# EAGLE schematic Gadget-Box-328pb (EAGLE 6.6.0)

## Sheet 1 of 3
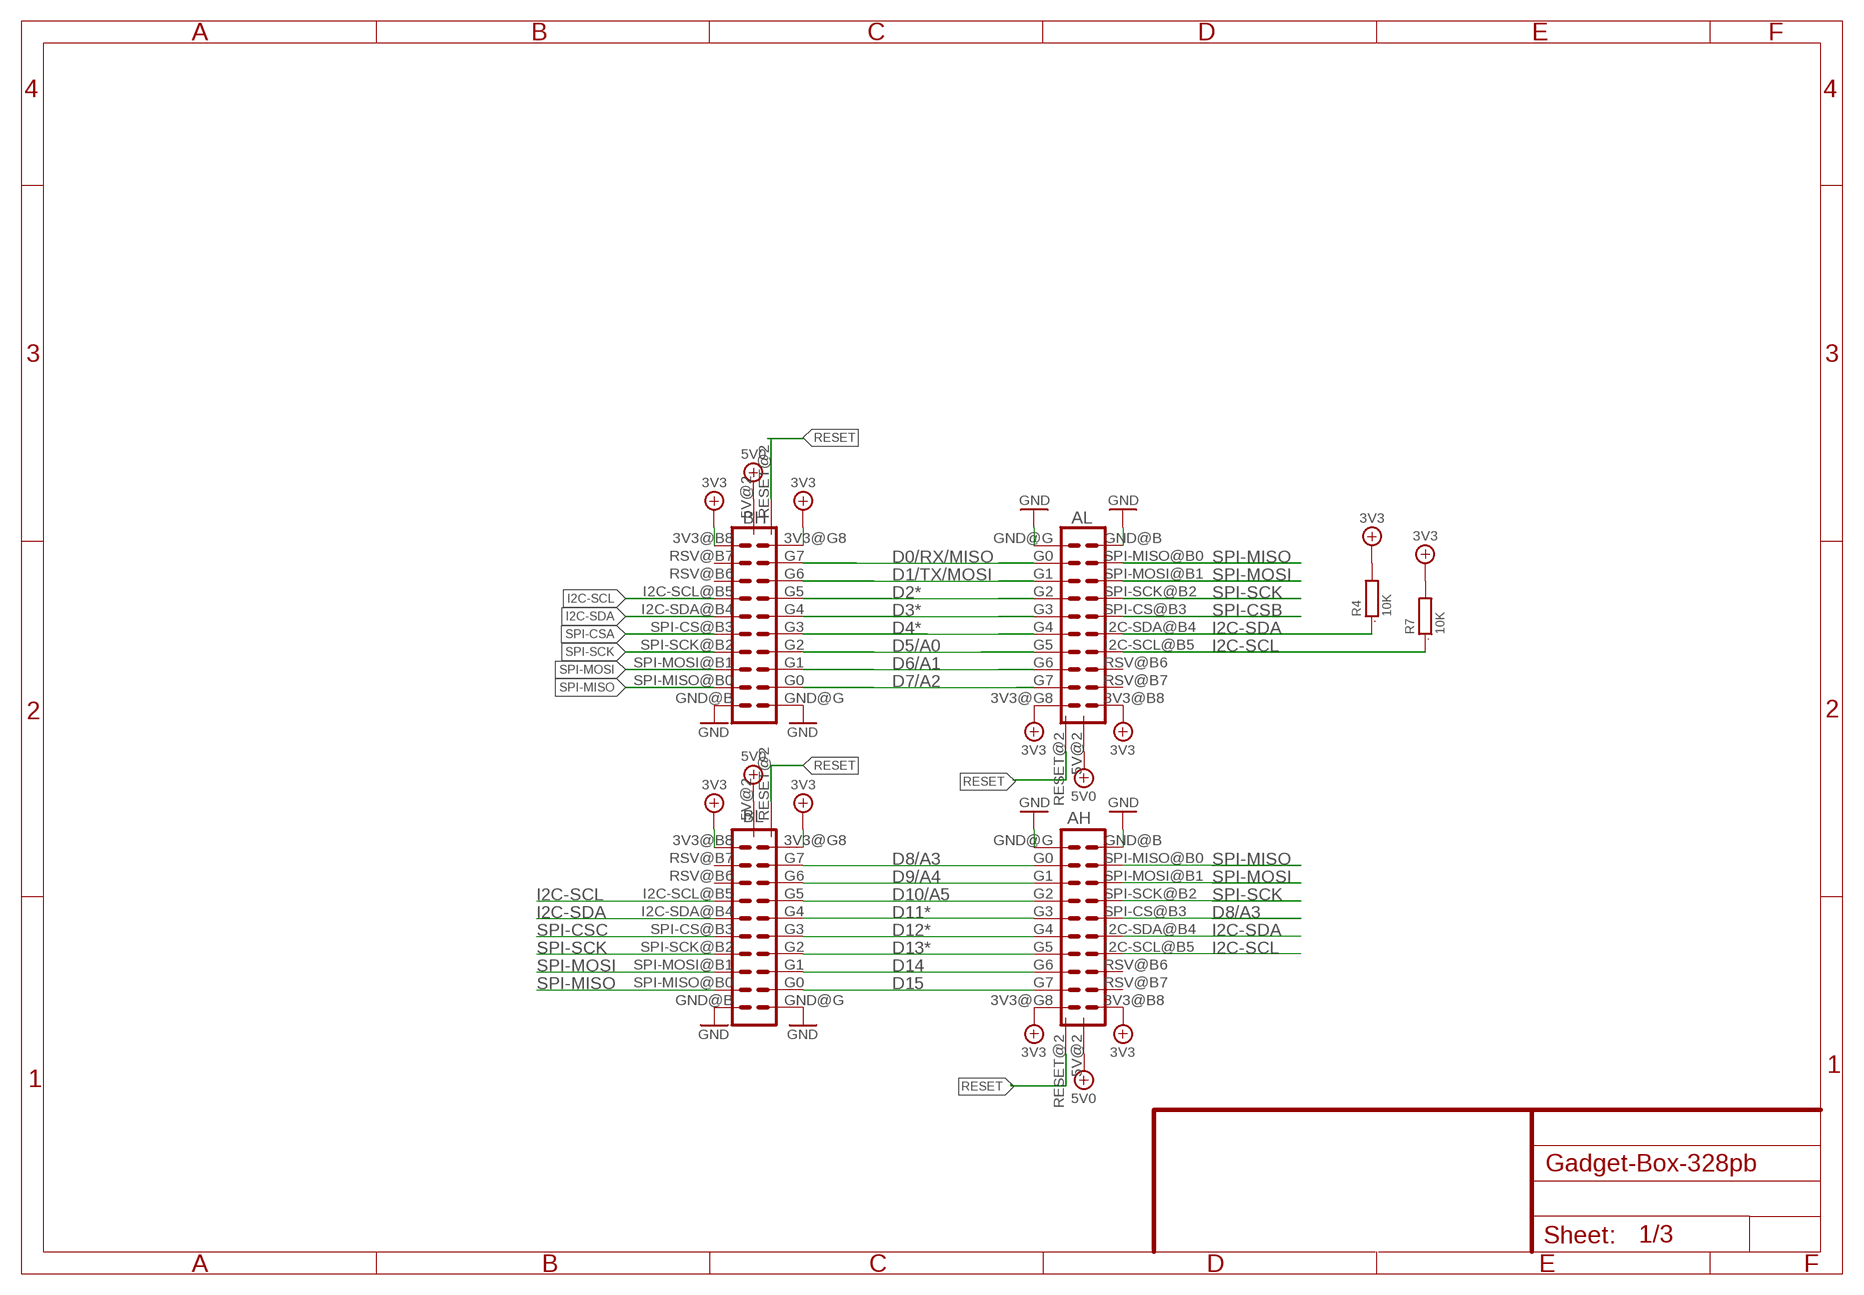
[diagram p0: schematic, sheet 1]

### Parts
AH  ECOGECOG_SLOT_ALT1  [ECOG_ALT1]
AL  ECOGECOG_SLOT_ALT1  [ECOG_ALT1]
BH  ECOGECOG_SLOT_ALT1  [ECOG_ALT1]
BL  ECOGECOG_SLOT_ALT1  [ECOG_ALT1]
R4  10K  R0603  [0603]
R7  10K  R0603  [0603]

### Nets
3V3: AH.3V3@B8(3V3) AH.3V3@G8(3V3) AL.3V3@B8(3V3) AL.3V3@G8(3V3) BH.3V3@B8(3V3) BH.3V3@G8(3V3) BL.3V3@B8(3V3) BL.3V3@G8(3V3) R4.2 R7.2 ; also sheet 2,3
5V0: AH.5V@2(5V) AL.5V@2(5V) BH.5V@2(5V) BL.5V@2(5V) ; also sheet 2
D0/RX/MISO: AL.G0 BH.G7 ; also sheet 3
D1/TX/MOSI: AL.G1 BH.G6 ; also sheet 3
D2*: AL.G2 BH.G5 ; also sheet 3
D3*: AL.G3 BH.G4 ; also sheet 3
D4*: AL.G4 BH.G3 ; also sheet 3
D5/A0: AL.G5 BH.G2 ; also sheet 2,3
D6/A1: AL.G6 BH.G1 ; also sheet 3
D7/A2: AL.G7 BH.G0 ; also sheet 3
D8/A3: AH.G0 AH.SPI-CS@B3(SPI-CS) BL.G7 ; also sheet 3
D9/A4: AH.G1 BL.G6 ; also sheet 3
D10/A5: AH.G2 BL.G5 ; also sheet 3
D11*: AH.G3 BL.G4 ; also sheet 3
D12*: AH.G4 BL.G3 ; also sheet 3
D13*: AH.G5 BL.G2 ; also sheet 3
D14: AH.G6 BL.G1 ; also sheet 3
D15: AH.G7 BL.G0 ; also sheet 3
GND [gnd]: AH.GND@B(GND) AH.GND@G(GND) AL.GND@B(GND) AL.GND@G(GND) BH.GND@B(GND) BH.GND@G(GND) BL.GND@B(GND) BL.GND@G(GND) ; also sheet 2,3
I2C-SCL: AH.I2C-SCL@B5(I2C-SCL) AL.I2C-SCL@B5(I2C-SCL) BH.I2C-SCL@B5(I2C-SCL) BL.I2C-SCL@B5(I2C-SCL) R7.1 ; also sheet 3
I2C-SDA: AH.I2C-SDA@B4(I2C-SDA) AL.I2C-SDA@B4(I2C-SDA) BH.I2C-SDA@B4(I2C-SDA) BL.I2C-SDA@B4(I2C-SDA) R4.1 ; also sheet 3
RESET: AH.RESET@2(RESET) AL.RESET@2(RESET) BH.RESET@2(RESET) BL.RESET@2(RESET) ; also sheet 3
SPI-CSA: BH.SPI-CS@B3(SPI-CS) ; also sheet 3
SPI-CSB: AL.SPI-CS@B3(SPI-CS) ; also sheet 3
SPI-CSC: BL.SPI-CS@B3(SPI-CS) ; also sheet 3
SPI-MISO: AH.SPI-MISO@B0(SPI-MISO) AL.SPI-MISO@B0(SPI-MISO) BH.SPI-MISO@B0(SPI-MISO) BL.SPI-MISO@B0(SPI-MISO) ; also sheet 3
SPI-MOSI: AH.SPI-MOSI@B1(SPI-MOSI) AL.SPI-MOSI@B1(SPI-MOSI) BH.SPI-MOSI@B1(SPI-MOSI) BL.SPI-MOSI@B1(SPI-MOSI) ; also sheet 3
SPI-SCK: AH.SPI-SCK@B2(SPI-SCK) AL.SPI-SCK@B2(SPI-SCK) BH.SPI-SCK@B2(SPI-SCK) BL.SPI-SCK@B2(SPI-SCK) ; also sheet 3
Unconnected: AH.RSV@B6(RSV) AH.RSV@B7(RSV) AL.RSV@B6(RSV) AL.RSV@B7(RSV) BH.RSV@B6(RSV) BH.RSV@B7(RSV) BL.RSV@B6(RSV) BL.RSV@B7(RSV)

## Sheet 2 of 3
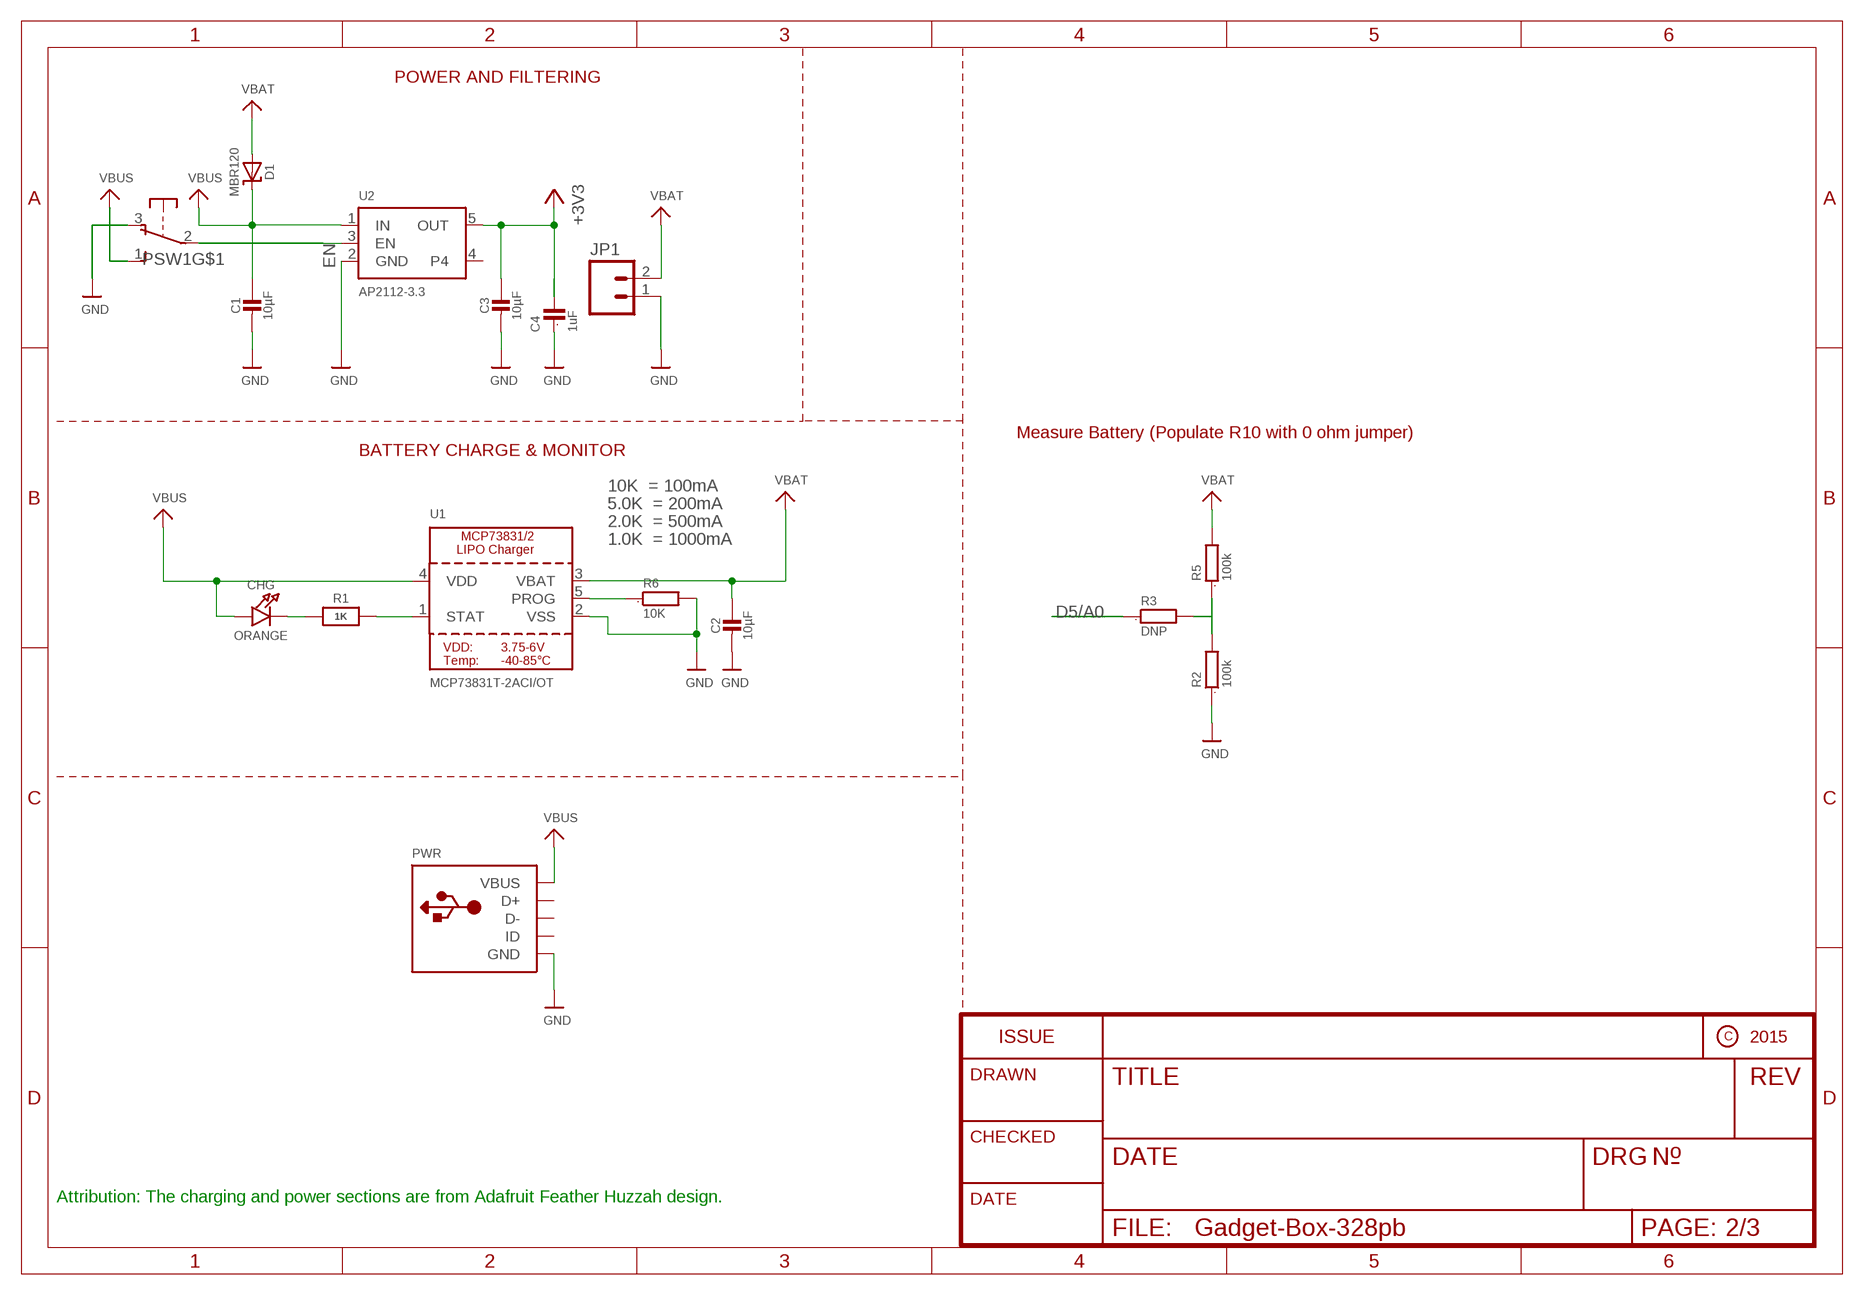
[diagram p1: schematic, sheet 2]

### Parts
C1  10µF  CAP_CERAMIC0805-NOOUTLINE  [0805-NO]
C2  10µF  CAP_CERAMIC0805-NOOUTLINE  [0805-NO]
C3  10µF  CAP_CERAMIC0805-NOOUTLINE  [0805-NO]
C4  1uF  C0603  [0603]
CHG  ORANGE  LED0805_NOOUTLINE  [CHIPLED_0805_NOOUTLINE]
D1  MBR120  DIODE-SCHOTTKYSOD-123  [SOD-123]
JP1  M02-JST-2-PTH-NO_SILK  [JST-2-PTH-NS]
PSW1  OS102011MA1Q  [OS102011MA1Q]
PWR  USBMINIB  [USB-MINIB]
R1  1K  RESISTOR_0603_NOOUT  [0603-NO]
R2  100k  R0603  [0603]
R3  DNP  R0603  [0603]
R5  100k  R0603  [0603]
R6  10K  R0603  [0603]
U1  MCP73831T-2ACI/OT  MCP73831/2  [SOT23-5]
U2  AP2112-3.3  VREG_SOT23-5  [SOT23-5]

### Nets
3V3: C3.1 C4.2 U2.5(OUT) ; supply symbol labelled +3V3 ; also sheet 1,3
5V0: C1.1 CHG.A D1.C PSW1.1(S) PWR.VBUS U1.4(VDD) U2.1(IN) ; supply symbol labelled VBUS ; also sheet 1
D5/A0: R3.1 ; also sheet 1,3
EN: PSW1.2(P) U2.3(EN)
GND [gnd]: C1.2 C2.2 C3.2 C4.1 JP1.1 PSW1.3(O) PWR.GND R2.1 R6.2 U1.2(VSS) U2.2(GND) ; also sheet 1,3
N$1: CHG.C R1.1
N$2: R2.2 R3.2 R5.1
N$3: R1.2 U1.1(STAT)
N$4: R6.1 U1.5(PROG)
VBAT: C2.1 D1.A JP1.2 R5.2 U1.3(VBAT)
Unconnected: PSW1.MT1(MT) PSW1.MT2(MT) PWR.D+ PWR.D- PWR.ID U2.4

### Notes on the sheet
- POWER AND FILTERING
- Measure Battery (Populate R10 with 0 ohm jumper)
- BATTERY CHARGE & MONITOR
- 10K  = 100mA
- 5.0K  = 200mA
- 2.0K  = 500mA
- 1.0K  = 1000mA
- Attribution: The charging and power sections are from Adafruit Feather Huzzah design.

## Sheet 3 of 3
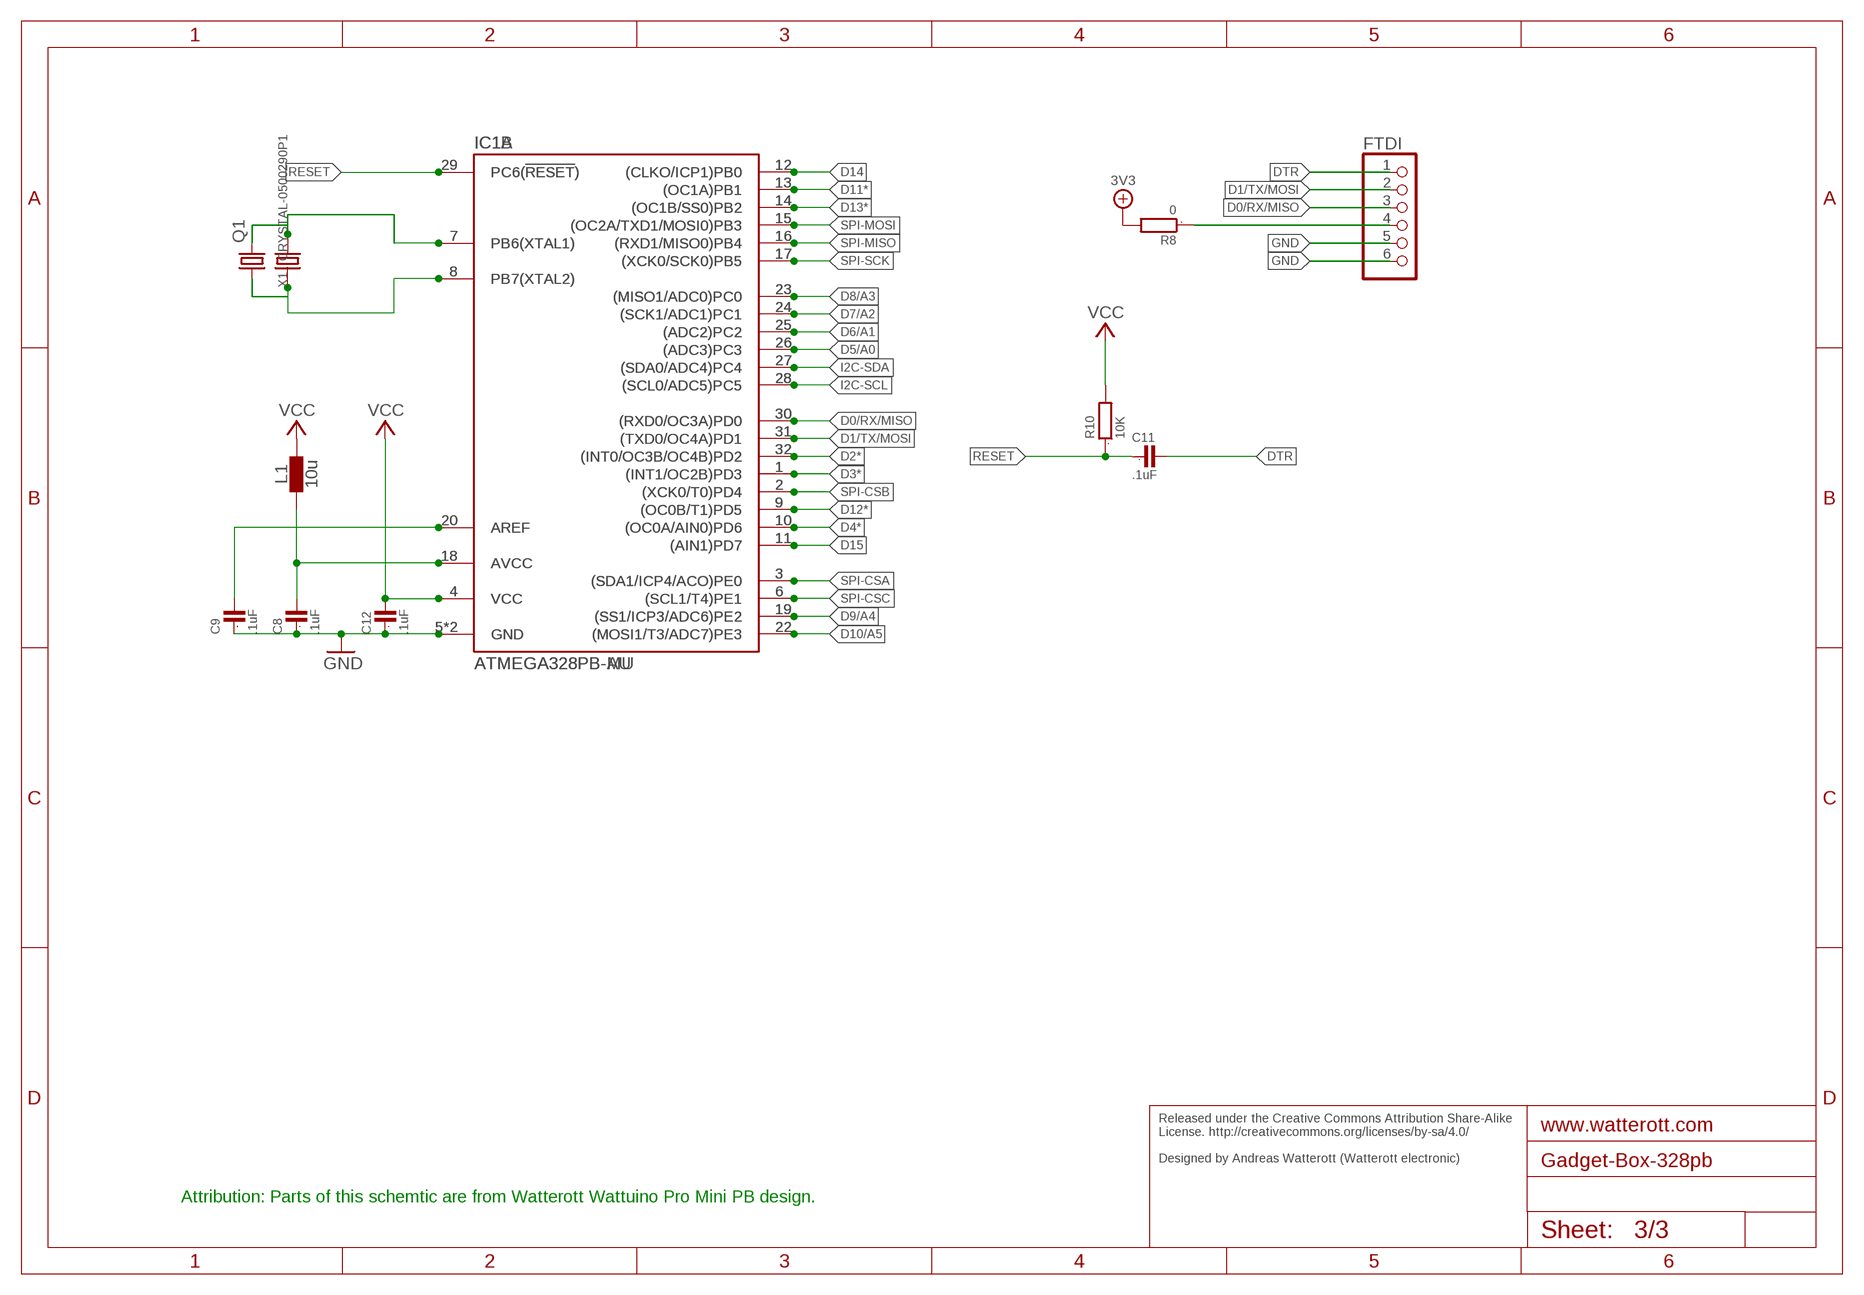
[diagram p2: schematic, sheet 3]

### Parts
C8  .1uF  C0805  [0805]
C9  .1uF  C0805  [0805]
C11  .1uF  C0805  [0805]
C12  .1uF  C0805  [0805]
FTDI  PINHD-1X6  [1X06]
IC1A  ATMEGA328PB-AU  [TQFP32]
IC1B  ATMEGA328PB-MU  [QFN32-PAD]
L1  10u  INDUCTOR-0603  [C0603]
Q1  CRYSTALSM49  [SM49]
R8  0  R0603  [0603]
R10  10K  R0603  [0603]
X1  CRYSTAL-0500290P1  [2P-SMD-5.0X3.2]

### Nets
3V3: C12.2 IC1A.4(VCC) IC1B.4(VCC) L1.2 R8.2 R10.2 ; supply symbol labelled VCC ; also sheet 1,2
AREF: C9.2 IC1A.20(AREF) IC1B.20(AREF)
AVCC: C8.2 IC1A.18(AVCC) IC1B.18(AVCC) L1.1
D0/RX/MISO: FTDI.3 IC1A.30((RXD0/OC3A)PD0) IC1B.30((RXD0/OC3A)PD0) ; also sheet 1
D1/TX/MOSI: FTDI.2 IC1A.31((TXD0/OC4A)PD1) IC1B.31((TXD0/OC4A)PD1) ; also sheet 1
D2*: IC1A.32((INT0/OC3B/OC4B)PD2) IC1B.32((INT0/OC3B/OC4B)PD2) ; also sheet 1
D3*: IC1A.1((INT1/OC2B)PD3) IC1B.1((INT1/OC2B)PD3) ; also sheet 1
D4*: IC1A.10((OC0A/AIN0)PD6) IC1B.10((OC0A/AIN0)PD6) ; also sheet 1
D5/A0: IC1A.26((ADC3)PC3) IC1B.26((ADC3)PC3) ; also sheet 1,2
D6/A1: IC1A.25((ADC2)PC2) IC1B.25((ADC2)PC2) ; also sheet 1
D7/A2: IC1A.24((SCK1/ADC1)PC1) IC1B.24((SCK1/ADC1)PC1) ; also sheet 1
D8/A3: IC1A.23((MISO1/ADC0)PC0) IC1B.23((MISO1/ADC0)PC0) ; also sheet 1
D9/A4: IC1A.19((SS1/ICP3/ADC6)PE2) IC1B.19((SS1/ICP3/ADC6)PE2) ; also sheet 1
D10/A5: IC1A.22((MOSI1/T3/ADC7)PE3) IC1B.22((MOSI1/T3/ADC7)PE3) ; also sheet 1
D11*: IC1A.13((OC1A)PB1) IC1B.13((OC1A)PB1) ; also sheet 1
D12*: IC1A.9((OC0B/T1)PD5) IC1B.9((OC0B/T1)PD5) ; also sheet 1
D13*: IC1A.14((OC1B/SS0)PB2) IC1B.14((OC1B/SS0)PB2) ; also sheet 1
D14: IC1A.12((CLKO/ICP1)PB0) IC1B.12((CLKO/ICP1)PB0) ; also sheet 1
D15: IC1A.11((AIN1)PD7) IC1B.11((AIN1)PD7) ; also sheet 1
DTR: C11.2 FTDI.1
GND [gnd]: C8.1 C9.1 C12.1 FTDI.5 FTDI.6 IC1A.5(GND) IC1A.21(GND) IC1B.5(GND) IC1B.21(GND) ; also sheet 1,2
I2C-SCL: IC1A.28((SCL0/ADC5)PC5) IC1B.28((SCL0/ADC5)PC5) ; also sheet 1
I2C-SDA: IC1A.27((SDA0/ADC4)PC4) IC1B.27((SDA0/ADC4)PC4) ; also sheet 1
N$5: IC1A.8(PB7(XTAL2)) IC1B.8(PB7(XTAL2)) Q1.1 X1.1
N$6: IC1A.7(PB6(XTAL1)) IC1B.7(PB6(XTAL1)) Q1.2 X1.2
N$7: FTDI.4 R8.1
RESET: C11.1 IC1A.29(PC6(!RESET!)) IC1B.29(PC6(!RESET!)) R10.1 ; also sheet 1
SPI-CSA: IC1A.3((SDA1/ICP4/ACO)PE0) IC1B.3((SDA1/ICP4/ACO)PE0) ; also sheet 1
SPI-CSB: IC1A.2((XCK0/T0)PD4) IC1B.2((XCK0/T0)PD4) ; also sheet 1
SPI-CSC: IC1A.6((SCL1/T4)PE1) IC1B.6((SCL1/T4)PE1) ; also sheet 1
SPI-MISO: IC1A.16((RXD1/MISO0)PB4) IC1B.16((RXD1/MISO0)PB4) ; also sheet 1
SPI-MOSI: IC1A.15((OC2A/TXD1/MOSI0)PB3) IC1B.15((OC2A/TXD1/MOSI0)PB3) ; also sheet 1
SPI-SCK: IC1A.17((XCK0/SCK0)PB5) IC1B.17((XCK0/SCK0)PB5) ; also sheet 1

### Notes on the sheet
- Released under the Creative Commons Attribution Share-Alike 
  License. http://creativecommons.org/licenses/by-sa/4.0/
  
  Designed by Andreas Watterott (Watterott electronic)
- Attribution: Parts of this schemtic are from Watterott Wattuino Pro Mini PB design.

## Library data of the parts
AH AL BH BL = eCogs:ECOG; PARTNO: PPPC102LFBN-RC,SULLINS CONNECTOR SOLUTIONS,dk,S6106-ND,"CONN HEADER FEM 20POS.1"" DL GOLD", REF67
C1-C3 = microbuilder:CAP_CERAMIC: Ceramic Capacitors For new designs, use the packages preceded by an '_' character since they are more reliable: The following footprints should be used on most boards: _0402 - Standard footprint for regular board layouts _0603 - Standard footprint for regular board layouts _0805 - Standard footprint for regular board layouts _1206 - Standard footprint for regular board layouts For extremely tight-pitch boards where space is at a premium, the following 'micro-pitch' footprints can be used (smaller pads, no silkscreen outline, etc.): _0402MP - Micro-pitch footprint for very dense/compact boards _0603MP - Micro-pitch footprint for very dense/compact boards _0805MP - Micro-pitch footprint for very dense/compact boards _1206MP - Micro-pitch footprint for very dense/compact boards; PARTNO: CL21F106ZPFNNNE,Samsung,DK,1276-3012-1-ND,CAP CER 10UF 10V Y5V 0805, REF1
C4 = GadgetFactory:C: CAPACITOR, European symbol; PARTNO: C1608X5R1A105K080AC,TDK CORPORATION (VA),dk,445-1321-1-ND,CAP CER 1UF 10V X5R 0603, REF53
C8 C9 C11 C12 = GadgetFactory:C: CAPACITOR, European symbol; PARTNO: GRM21BR71E104KA01L,MURATA ELECTRONICS (VA),DK,490-1673-1-ND,CAP CER .1UF 25V 10% X7R 0805, REF3
CHG = microbuilder:LED: LED 0603 - 0603 Surface Mount Package 2mA: Green LED - Low Power (3.9mcd, 2ma, 1.7Vf) - Digikey: 475-2709-2-ND Orange LED - Low Power (9.8mcd, 2ma, 1.8Vf) - Digikey: 475-1194-2-ND Red LED - Low Power (5mcd, 2ma, 1.8Vf) - Digikey: 475-1195-2-ND Yellow LED - Low Power (7mcd, 2ma, 1.8Vf) - Digikey: 475-1196-2-ND 5mA: Blue LED - Low Power (17mcd, 5ma, 2.9Vf) - Digikey: LNJ937W8CRACT-ND 0805 - 0805 Surface Mount Package 2mA: Red LED (8.8mcd, 2mA, 1.8Vf, Clear) - Low Power [Digikey: 475-2510-1-ND] Green LED (5mcd, 2mA, 1.8Vf, Clear) - Low Power [Digikey: 475-2730-1-ND] Yellow LED (11.3mcd, 2mA, 1.8Vf, Clear) - Low Power [Digikey: 475-2555-1-ND] 20mA: Red LED (104mcd, 20mA, Diffused) - LS R976 [Digikey: 475-1278-6-ND] Red LED (12mcd, 20mA, 2.0Vf, Clear) - APT2012EC [Digikey: 754-1128-1-ND] Green LED (15mcd, 20mA, 2.2Vf, Clear) - APT2012GC [Digikey: 754-1131-1-ND] Orange LED (160mcd, 20mA, 2.1Vf, Clear) - APT2012SECK [Digikey: 754-1130-1-ND] 1206 - 1206 Surface Mount Package Green LED (26mcd, 20mA, Diffused) - LG N971 [Digikey: 475-1407-6-ND] Red LED (15mcd, 20mA, Diffused) - LH N974 [Digikey: 475-1416-6-ND] Cree - Cree High-Power Surface Mount LEDs XPEBWT-L1-0000-00D50 - White 111lm 350mA 2.9Vf 6200K 110° XTEAWT-00-0000-00000LEE3 - White 114lm 350mA 2.85Vf 5000K 115° Everlight - Everlight 45-21 Series Surface Mount LEDs 45-21/QK2C-B2832AC2CB2/2T - Warm White 2000mcd 20mA 3.25Vf 3050K 120° 45-21/LK2C-B38452C4CB2/2T - Nuetral White 2000mcd 20mA 3.25Vf 4150K 120° 45-21/LK2C-B50634C6CB2/2T - Cold White 2200mcd 20mA 3.25Vf 5650K 120° PLCC2 Reverse Mount LS T77K-J1L2-1-0-2-R18-Z - Red 11.25mcd 2mA 1.8Vf 630nm 120° LO T77K-L1M2-24-Z - Orange 19.6mcd 2mA 1.8Vf 606nm 120° LY T77K-K2M1-26-Z - Yellow 15.7mcd 2mA 1.8Vf 587nm 120°; PARTNO: LTST-C171EKT,LITE-ON INC (VA),DK,160-1422-1-ND,LED RED ORAN CLEAR THIN 0805 SMD, REF6
D1 = microbuilder:DIODE-SCHOTTKY; PARTNO: MBR120VLSFT3G,on semiconductor,dk,MBR120VLSFT3GOSCT-ND ,DIODE SCHOTTKY 20V 1A SOD123FL , REF71
FTDI = GadgetFactory:PINHD-1X6: PIN HEADER; PARTNO: PPPC061LGBN-RC,SULLINS CONNECTOR SOLUTIONS,dk,S5481-ND ,"6 Position Header Connector 0.100"" (2.54mm) Through Hole - Right Angle Gold ", REF91
IC1A = we-chip:ATMEGA328PB: Atmel ATmeg328PB AVR Microcontroller; PARTNO: ATMEGA328PB-AUR,ATMEL (VA),dk,ATMEGA328PB-AURCT-ND ,AVR AVR ATmega Microcontroller IC 8-Bit 20MHz 32KB (16K x 16) FLASH 32-TQFP (7x7) , REF90
IC1B = we-chip:ATMEGA328PB: Atmel ATmeg328PB AVR Microcontroller; BOM: EXCLUDE
JP1 = SparkFun:M02: Header 2 Standard 2-pin 0.1" header. Use with straight break away headers (SKU : PRT-00116), right angle break away headers (PRT-00553), swiss pins (PRT-00743), machine pins (PRT-00117), and female headers (PRT-00115). Molex polarized connector foot print use with SKU : PRT-08233 with associated crimp pins and housings.; PARTNO: B2B-PH-SM4-TB(LF)(SN),JST SALES AMERICA INC (VA),dk,455-1734-1-ND ,"2 Positions Header, Shrouded Connector 0.079 (2.00mm) Through Hole Tin ", REF87
L1 = we-rcl:INDUCTOR: Inductors Ferrite Bead 0603 1.4A 220Ohm @ 100MH, -> Murata BLM18PG221SH1D 0603 1.0A 20Ohm @ 100MH -> Murata BLM18PG300SN1D; PARTNO: MLZ1608E100M,TDK CORPORATION (VA),dk,445-3166-1-ND,10µH Shielded Multilayer Inductor 40mA 900 mOhm 0603 , REF89
PSW1 = adafruit:OS102011MA1Q: OS10201MA1Q through-hole right angle switch http://www.ladyada.net/library/eagle; PARTNO: OS102011MA1QN1,C&K Components,dk,CKN9559-ND,SWITCH SLIDE SPDT 100MA 12V , REF72
PWR = adafruit:USB: USB Connectors USBMINIB - Surface Mount Female Mini-B USB Connector 4UConnector: 06564 By microbuilder.eu Thru-hole RA Female Mini-B USB Connector 4UConnector: 18732 By ladyada.net; PARTNO: USB-M26FTR,On Shore Technology Inc,DK,ED2992CT-ND,MINI-USB-B Connector, REF22
Q1 = crystal:CRYSTAL: CRYSTAL; OC_FARNELL: unknown; OC_NEWARK: unknown; PARTNO: ABLS-8.000MHZ-B4-T,Abracon Corporation,dk,535-10212-1-ND ,8MHz ±30ppm Crystal 18pF 80 Ohm -20°C ~ 70°C Surface Mount HC49/US , REF102
R1 = microbuilder:RESISTOR: Resistors For new designs, use the packages preceded by an '_' character since they are more reliable: The following footprints should be used on most boards: _0402 - Standard footprint for regular board layouts _0603 - Standard footprint for regular board layouts _0805 - Standard footprint for regular board layouts _1206 - Standard footprint for regular board layouts For extremely tight-pitch boards where space is at a premium, the following 'micro-pitch' footprints can be used (smaller pads, no silkscreen outline, etc.): _0402MP - Micro-pitch footprint for very dense/compact boards _0603MP - Micro-pitch footprint for very dense/compact boards _0805MP - Micro-pitch footprint for very dense/compact boards _1206MP - Micro-pitch footprint for very dense/compact boards; PARTNO: RC0603JR-071KL,YAGEO (VA),dk,311-1.0KGRTR-ND,RES SMD 1K OHM 5% 1/10W 0603 , REF73
R2 R5 = GadgetFactory:R: RESISTOR, European symbol; PARTNO: RC0603JR-07100KL,YAGEO (VA),dk,311-100KGRCT-ND,RES SMD 100K OHM 5% 1/10W 0603 , REF76
R3 R8 = GadgetFactory:R: RESISTOR, European symbol; BOM: EXCLUDE
R4 R6 R7 R10 = GadgetFactory:R: RESISTOR, European symbol; PARTNO: RC0603JR-0710KL,YAGEO (VA),dk,311-10KGRCT-ND,RES SMD 10K OHM 5% 1/10W 0603 , REF36
U1 = microbuilder:MCP73831/2: MCP73831/2 LIPO Charger VDD: 3.75 - 6V Temp -40 - 85°C Programmable Charge Rate: 15-500mA NOTE: STAT is a tri-state logic output on the MCP73831 and an open-drain output on the MCP73832. SOT23-5 with 4.2V output and tri-state logic on STAT = MCP73831T-2ACI/OT; PARTNO: MCP73831T-2ACI/OT,MICROCHIP TECHNOLOGY (VA),dk,MCP73831T-2ACI/OTCT-ND,IC CONTROLLR LI-ION 4.2V SOT23-5, REF74
U2 = microbuilder:VREG_SOT23-5: SOT23-5 Fixed Voltage Regulators Part Current Out V Out V In V Dropout θJA (°C/W) TJ (°C) Digikey Part No. ADP121 150mA 3.3V 3.4-5.5V 0.09V @ 150mA -- -- ADP121-AUJZ33R7CT-ND ADP121 150mA 3.0V 3.1-5.5V 0.09V @ 150mA -- -- ADP121-AUJZ30R7CT-ND ADP122 300mA 3.3V 3.4-5.5V 0.085V @ 300mA -- -- ADP122AUJZ-3.3-R7CT-ND ADP1712 300mA 3.3V 3.5-5.5V 0.17V @ 300mA -- -- ADP1712AUJZ-3.3-R7TR-ND AP7311 (Low Cost) 150mA 3.3V 3.5-6V 0.15V @ 150mA -- -- AP7311-33WG-7DICT-ND LD39015M18R 150mA 1.8V 1.9V-5.5V 0.08V @ 100mA -- -- 497-6977-1-ND LP2985A-33DBVR 150mA 3.3V 3.3-16V 0.28V @ 150mA 206 150 296-18479-1-ND MCP1824T-3302E/OT 300mA 3.3V 3.5V-6V 0.2V @ 300mA -- -- MCP1824T-3302E/OTCT-ND MIC5205-2.5YM5 TR 150mA 2.5V 2.7-16V 0.165V @ 150mA -- -- 576-1257-2-ND MIC5205-3.0YM5 TR 150mA 3.0V 3.2V-16V 0.165V @ 150mA -- -- 576-1258-2-ND MIC5205-3.3YM5 TR 150mA 3.3V 3.5V-16V 0.165V @ 150mA -- -- 576-1259-2-ND TPS780330220 150mA 3.3V+2.2V 3.6-5.5V 250mV Max -- -- 296-23332-1-ND TDA3663/N1,135 100mA 3.3V 3.5-45V 0.18V @ 50mA -- -- 568-5343-1-ND Max operating temp can be calculated using θJA, TJ (max junction temperature), and power in watts. Set the "Maximum Ambient Temperature" until it reaches TJ ("Max Junction Temperature"), which is the absolute limit for safe use of the regulator: Heat Sink Temperature Calculator <http://www.daycounter.com/Calculators/Heat-Sink-Temperature-Calculator.phtml> For example, With 12V source into a 3.3V LP2985 and a 30mA load, we are dissipating (12V-3.3V) * 0.03A = 0.261W. With a θJA of 206 °C/W, a TJ of 150°C, and 261mW we can safely use the chip without a heat sink up to 75°C (=147.1°C Junction Temperature).; PARTNO: AP2112K-3.3TRG1,Diodes Incorporated,dk,AP2112K-3.3TRG1DICT-ND,IC REG LDO 3.3V 0.6A SOT25 , REF75
X1 = OPL Eagle Library:CRYSTAL*; BOM: EXCLUDE; PARTNO: ABM3-8.000MHZ-D2Y-T,Abracon Corporation,dk,535-10630-1-ND ,CRYSTAL 8.0000MHZ 18PF SMD , REF70

## Net classes
2 gnd: width 0.254 mm, drill 0.381 mm, clearance 0.254 mm
3 usbvcc: width 0.254 mm, drill 0.381 mm, clearance 0.254 mm
4 aref: width 0.254 mm, drill 0.381 mm, clearance 0.254 mm